# Altium schematic sheet logic_qspi.SchDoc: mcHF Pro Transceiver UI board
size A3; Author: Krassi Atanassov; CompanyName: MØNKA; Engineer: For radio amateurs experimentation, non-commercial use only. Thank you!; Revision: 0.8.2; SheetTotal: 18
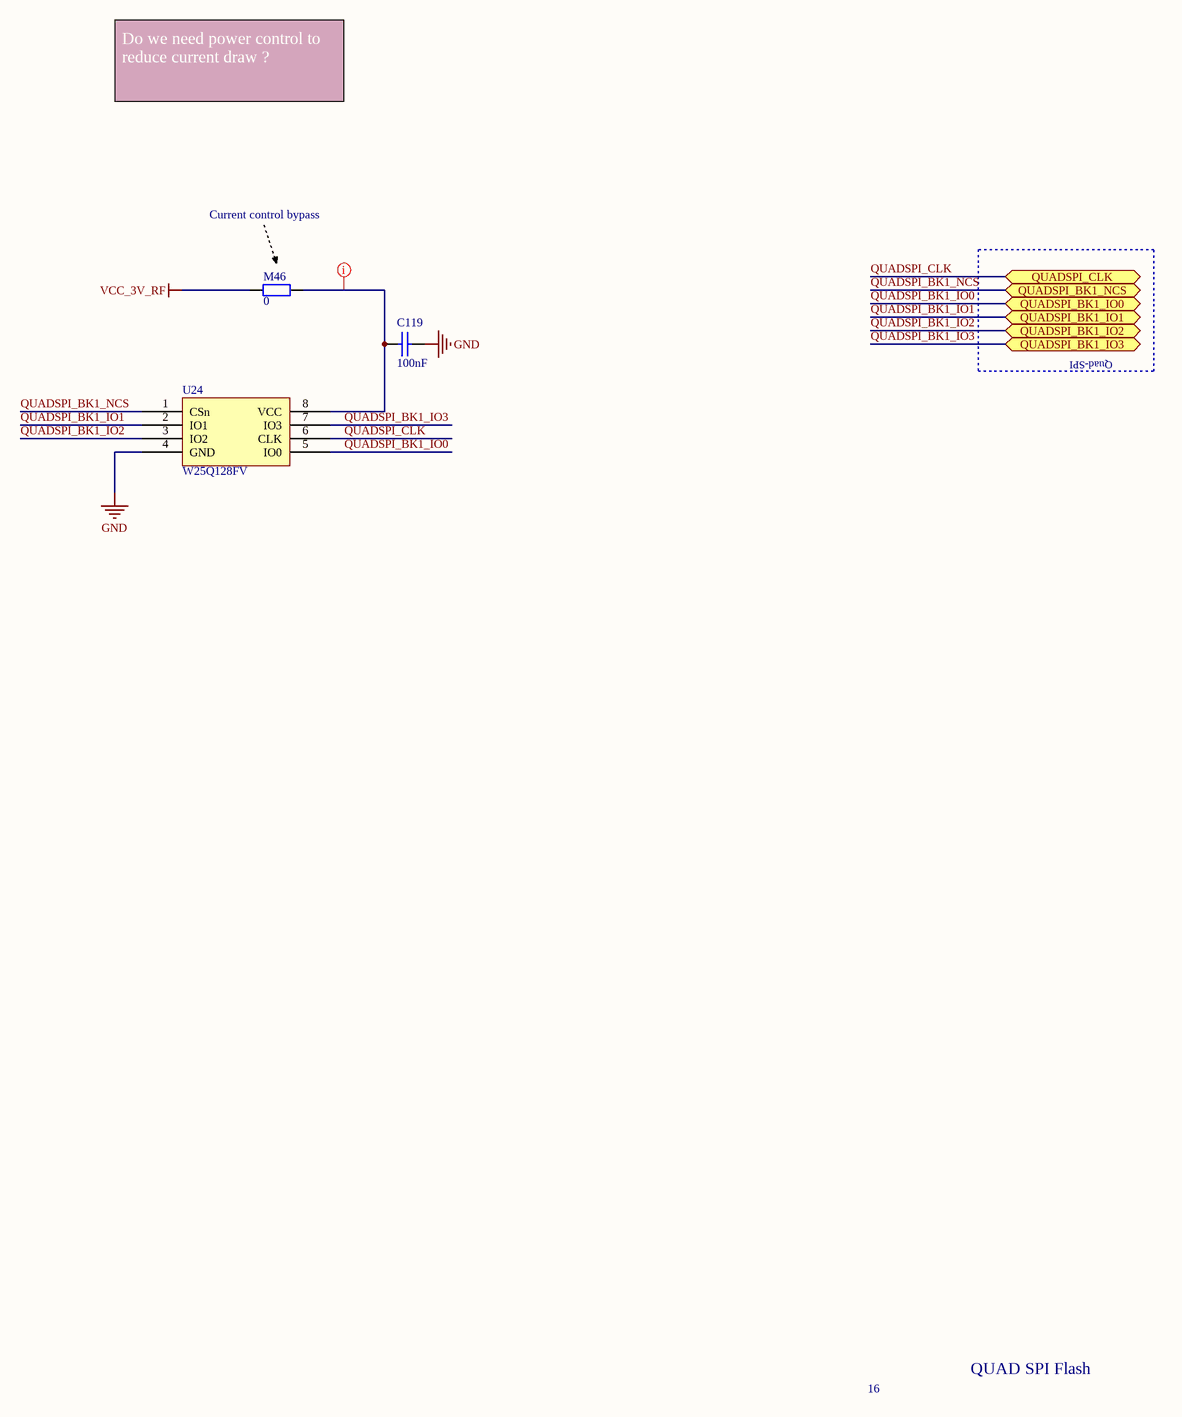
[diagram p0: logic_qspi.SchDoc]

## Parts
C119  100nF  [0805]
M46  0  [0805]
U24  W25Q128FV  [SOIC8_208MIL]

## Ports
QUADSPI_BK1_IO0 (bidir), QUADSPI_BK1_IO1 (bidir), QUADSPI_BK1_IO2 (bidir), QUADSPI_BK1_IO3 (bidir), QUADSPI_BK1_NCS (bidir), QUADSPI_CLK (bidir)

## Nets
GND: C119.2 U24.4(GND)
VCC_3V_RF: M46.1
QUADSPI_BK1_IO0: U24.5(IO0) ; port QUADSPI_BK1_IO0
QUADSPI_BK1_IO1: U24.2(IO1) ; port QUADSPI_BK1_IO1
QUADSPI_BK1_IO2: U24.3(IO2) ; port QUADSPI_BK1_IO2
QUADSPI_BK1_IO3: U24.7(IO3) ; port QUADSPI_BK1_IO3
QUADSPI_BK1_NCS: U24.1(CSn) ; port QUADSPI_BK1_NCS
QUADSPI_CLK: U24.6(CLK) ; port QUADSPI_CLK
NetC119_1: C119.1 M46.2 U24.8(VCC)

## Layout directives
rule Width Constraint [Pref Width = 12mil    Min Width = 12mil    Max Width = 12mil]: NetC119_1

## Notes on the sheet
- Do we need power control to reduce current draw ?
- Current control bypass
- Quad-SPI
- 16
- QUAD SPI Flash
- Date:
- File:
- Revision:
- Sheet
- of
- License:

## Library data of the parts
C119 = CAP: Capacitor; Order: FN 252-2090; QT Order: QCC-00154; Price: 0.068
M46 = RES: Resistor; Order: FN 933-3681; QT Order: QCR-00268; Price: 0.009
U24 = W25Q128FV: 3V 128Mbit QUAD SPI; Notes: Cheap from Ali, actual size TBD